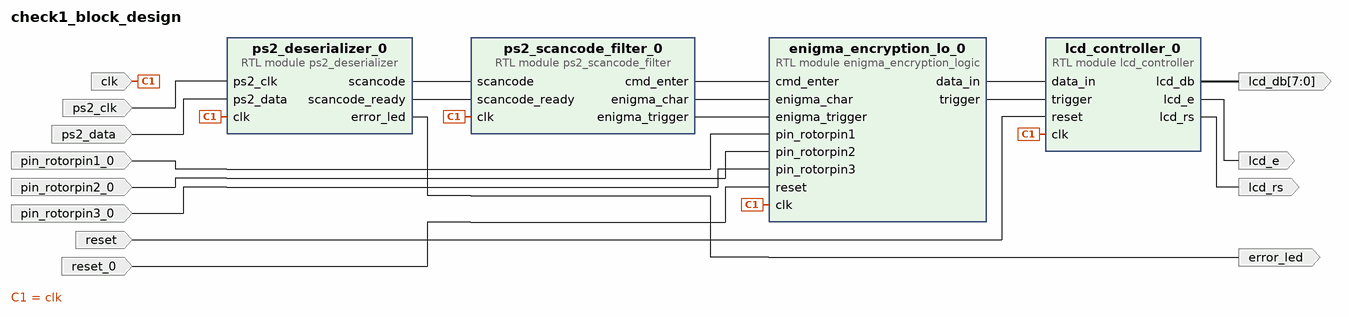
[diagram p0: block diagram of the top level]
# Vivado block design check1_block_design, xc7a35tcpg236-1, Vivado 2025.2
create_bd_design check1_block_design

create_bd_port -dir O error_led
create_bd_port -dir I -type rst reset
create_bd_port -dir I -type clk clk
create_bd_port -dir I -type clk ps2_clk
create_bd_port -dir I ps2_data
create_bd_port -dir O -from 7 -to 0 lcd_db
create_bd_port -dir O lcd_e
create_bd_port -dir O lcd_rs
create_bd_port -dir I -type rst reset_0
create_bd_port -dir I pin_rotorpin1_0
create_bd_port -dir I pin_rotorpin2_0
create_bd_port -dir I pin_rotorpin3_0

create_bd_cell -type module -reference lcd_controller lcd_controller_0
create_bd_cell -type module -reference ps2_deserializer ps2_deserializer_0
create_bd_cell -type module -reference ps2_scancode_filter ps2_scancode_filter_0
create_bd_cell -type module -reference enigma_encryption_logic enigma_encryption_lo_0

# ---- connections ----

connect_bd_net -net clk_0_1 [get_bd_ports clk] \
  [get_bd_pins lcd_controller_0/clk] [get_bd_pins ps2_deserializer_0/clk] [get_bd_pins ps2_scancode_filter_0/clk] \
  [get_bd_pins enigma_encryption_lo_0/clk]
connect_bd_net [get_bd_pins enigma_encryption_lo_0/data_in] [get_bd_pins lcd_controller_0/data_in]
connect_bd_net [get_bd_pins enigma_encryption_lo_0/trigger] [get_bd_pins lcd_controller_0/trigger]
connect_bd_net [get_bd_pins lcd_controller_0/lcd_db] [get_bd_ports lcd_db]
connect_bd_net [get_bd_pins lcd_controller_0/lcd_e] [get_bd_ports lcd_e]
connect_bd_net [get_bd_pins lcd_controller_0/lcd_rs] [get_bd_ports lcd_rs]
connect_bd_net -net pin_rotorpin1_0_1 [get_bd_ports pin_rotorpin1_0] [get_bd_pins enigma_encryption_lo_0/pin_rotorpin1]
connect_bd_net -net pin_rotorpin2_0_1 [get_bd_ports pin_rotorpin2_0] [get_bd_pins enigma_encryption_lo_0/pin_rotorpin2]
connect_bd_net -net pin_rotorpin3_0_1 [get_bd_ports pin_rotorpin3_0] [get_bd_pins enigma_encryption_lo_0/pin_rotorpin3]
connect_bd_net -net ps2_clk_0_1 [get_bd_ports ps2_clk] [get_bd_pins ps2_deserializer_0/ps2_clk]
connect_bd_net -net ps2_data_0_1 [get_bd_ports ps2_data] [get_bd_pins ps2_deserializer_0/ps2_data]
connect_bd_net [get_bd_pins ps2_deserializer_0/error_led] [get_bd_ports error_led]
connect_bd_net [get_bd_pins ps2_deserializer_0/scancode] [get_bd_pins ps2_scancode_filter_0/scancode]
connect_bd_net [get_bd_pins ps2_deserializer_0/scancode_ready] [get_bd_pins ps2_scancode_filter_0/scancode_ready]
connect_bd_net [get_bd_pins ps2_scancode_filter_0/cmd_enter] [get_bd_pins enigma_encryption_lo_0/cmd_enter]
connect_bd_net [get_bd_pins ps2_scancode_filter_0/enigma_char] [get_bd_pins enigma_encryption_lo_0/enigma_char]
connect_bd_net [get_bd_pins ps2_scancode_filter_0/enigma_trigger] [get_bd_pins enigma_encryption_lo_0/enigma_trigger]
connect_bd_net -net reset_0_1 [get_bd_ports reset] [get_bd_pins lcd_controller_0/reset]
connect_bd_net -net reset_0_2 [get_bd_ports reset_0] [get_bd_pins enigma_encryption_lo_0/reset]

validate_bd_design
save_bd_design
